# EAGLE design thumper2_v0001 (EAGLE 6.4)
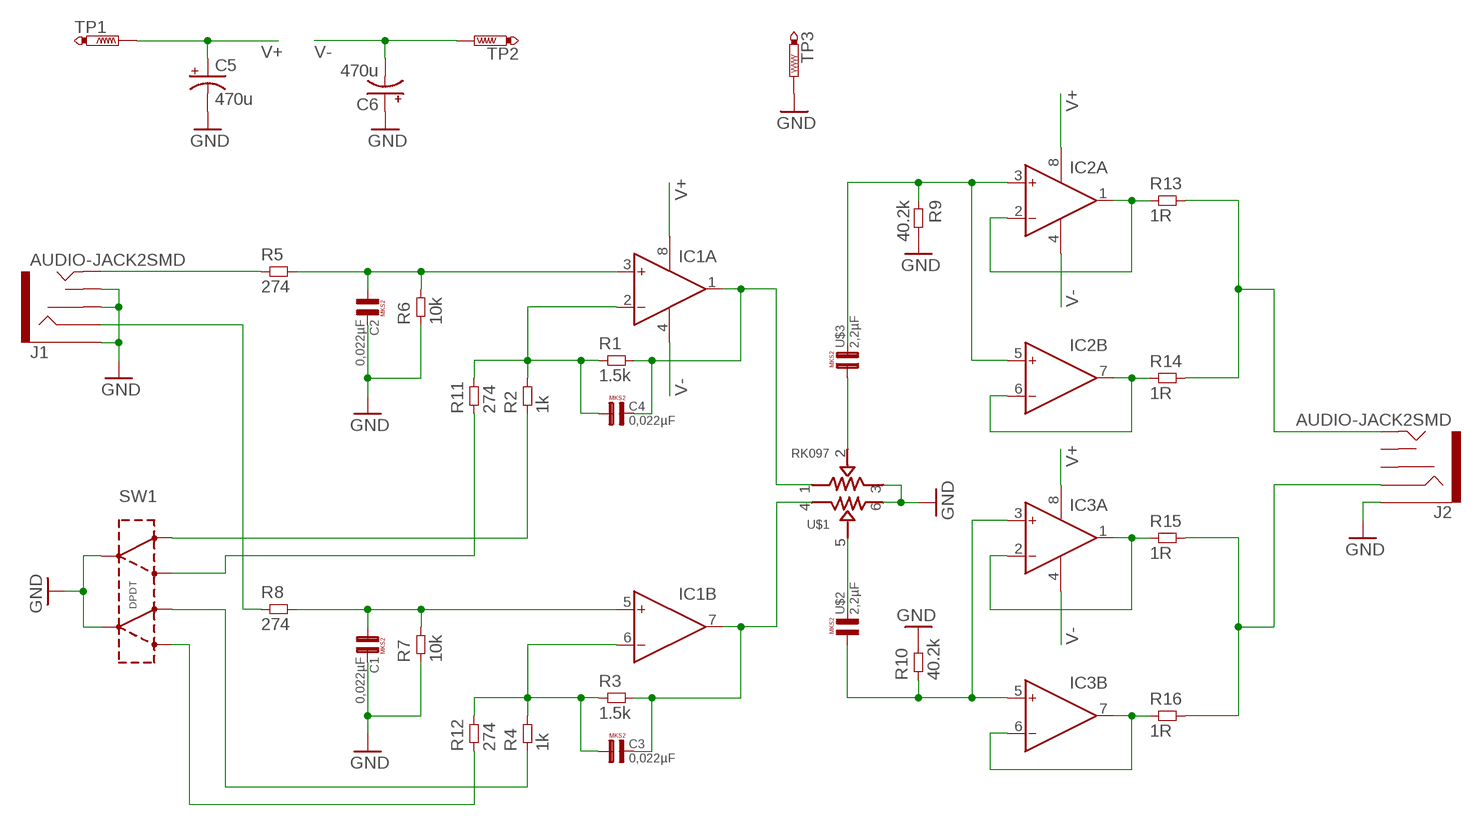
[diagram p0: schematic, sheet 1]

## Parts
C1  0,022µF  [R5B2K5]
C2  0,022µF  [R5B2K5]
C3  0,022µF  [R5B2K5]
C4  0,022µF  [R5B2K5]
C5  470u  CPOL-US153CLV-1010  [153CLV-1010]
C6  470u  CPOL-US153CLV-1010  [153CLV-1010]
IC1  AD8620R  [SO8]
IC2  AD8620R  [SO8]
IC3  AD8620R  [SO8]
J1  AUDIO-JACK2SMD  [AUDIO-JACK-3.5MM-SMD]
J2  AUDIO-JACK2SMD  [AUDIO-JACK-3.5MM-SMD]
R1  1.5k  RES0603L3  [0603L3]
R2  1k  RES0603L3  [0603L3]
R3  1.5k  RES0603L3  [0603L3]
R4  1k  RES0603L3  [0603L3]
R5  274  RES0603L3  [0603L3]
R6  10k  RES0603L3  [0603L3]
R7  10k  RES0603L3  [0603L3]
R8  274  RES0603L3  [0603L3]
R9  40.2k  RES0603L3  [0603L3]
R10  40.2k  RES0603L3  [0603L3]
R11  274  RES0603L3  [0603L3]
R12  274  RES0603L3  [0603L3]
R13  1R  RES1206L3  [1206L3]
R14  1R  RES1206L3  [1206L3]
R15  1R  RES1206L3  [1206L3]
R16  1R  RES1206L3  [1206L3]
SW1  DPDTDPDT-2X2.5  [DPDT-2X2.5]
TP1  PTR1PAD1-20  [P1-20]
TP2  PTR1PAD1-20  [P1-20]
TP3  PTR1PAD1-20  [P1-20]
U$1  RK097  [RK097]
U$2  2,2µF  [R5B7K2]
U$3  2,2µF  [R5B7K2]

## Nets
GND: C1.2 C2.2 C5.- C6.+ J1.RSH J1.SLEEVE J1.TSH J2.SLEEVE R6.P$1 R7.P$1 R9.P$2 R10.P$2 SW1.2(INA) SW1.5(INB) TP3.TP U$1.3 U$1.6
N$1: C2.1 IC1.3(A:IN+) R5.P$2 R6.P$2
N$2: C4.1 IC1.2(A:IN-) R1.P$1 R2.P$2 R11.P$2
N$3: C4.2 IC1.1(A:OUT) R1.P$2 U$1.1
N$4: C1.1 IC1.5(B:IN+) R7.P$2 R8.P$2
N$5: C3.2 IC1.7(B:OUT) R3.P$2 U$1.4
N$6: C3.1 IC1.6(B:IN-) R3.P$1 R4.P$2 R12.P$2
N$7: J2.TIP R13.2 R14.2
N$9: U$1.5 U$2.2
N$10: U$1.2 U$3.1
N$11: J2.RING R15.2 R16.2
N$12: IC3.3(A:IN+) IC3.5(B:IN+) R10.P$1 U$2.1
N$13: IC2.3(A:IN+) IC2.5(B:IN+) R9.P$1 U$3.2
N$14: IC2.6(B:IN-) IC2.7(B:OUT) R14.1
N$15: IC3.1(A:OUT) IC3.2(A:IN-) R15.1
N$16: IC3.6(B:IN-) IC3.7(B:OUT) R16.1
N$17: IC2.1(A:OUT) IC2.2(A:IN-) R13.1
N$19: R12.P$1 SW1.6(OUTB2)
N$20: R11.P$1 SW1.3(OUTA2)
N$21: R2.P$1 SW1.1(OUTA1)
N$22: R4.P$1 SW1.4(OUTB1)
N$24: J1.RING R8.P$1
N$25: J1.TIP R5.P$1
V+: C5.+ IC1.8(P:V+) IC2.8(P:V+) IC3.8(P:V+) TP1.TP
V-: C6.- IC1.4(P:V-) IC2.4(P:V-) IC3.4(P:V-) TP2.TP
Unconnected: J2.RSH J2.TSH

## Library data of the parts
C1-C4 = Capacitor-Wima-MKS2-63v:0,022µF
C5 C6 = rcl:CPOL-US: POLARIZED CAPACITOR, American symbol
IC1-IC3 = analog-devices:AD8620: Precision, Very Low Noise, Low Input Bias Current, Wide Bandwidth JFET Operational Amplifiers Source: http://www.analog.com/static/imported-files/data_sheets/AD8610_8620.pdf; MF: ALTERA CORPORATION; MPN: AD8620ARZ; OC_FARNELL: 9994386; OC_NEWARK: 59K6972
J1 J2 = SparkFun-Connectors:AUDIO-JACK2: Stereo audio jack with bypass switches. Used on LilyPad MP3 board. Production SKU: CONN-10353; PROD_ID: CONN-10353
R1-R16 = common:RES
SW1 = common:DPDT
TP1-TP3 = testpad:PTR1: TEST PIN
U$1 = SparkFun-Electromechanical:RK097
U$2 U$3 = Capacitor-Wima-MKS2-63v:2,2µF

## Board
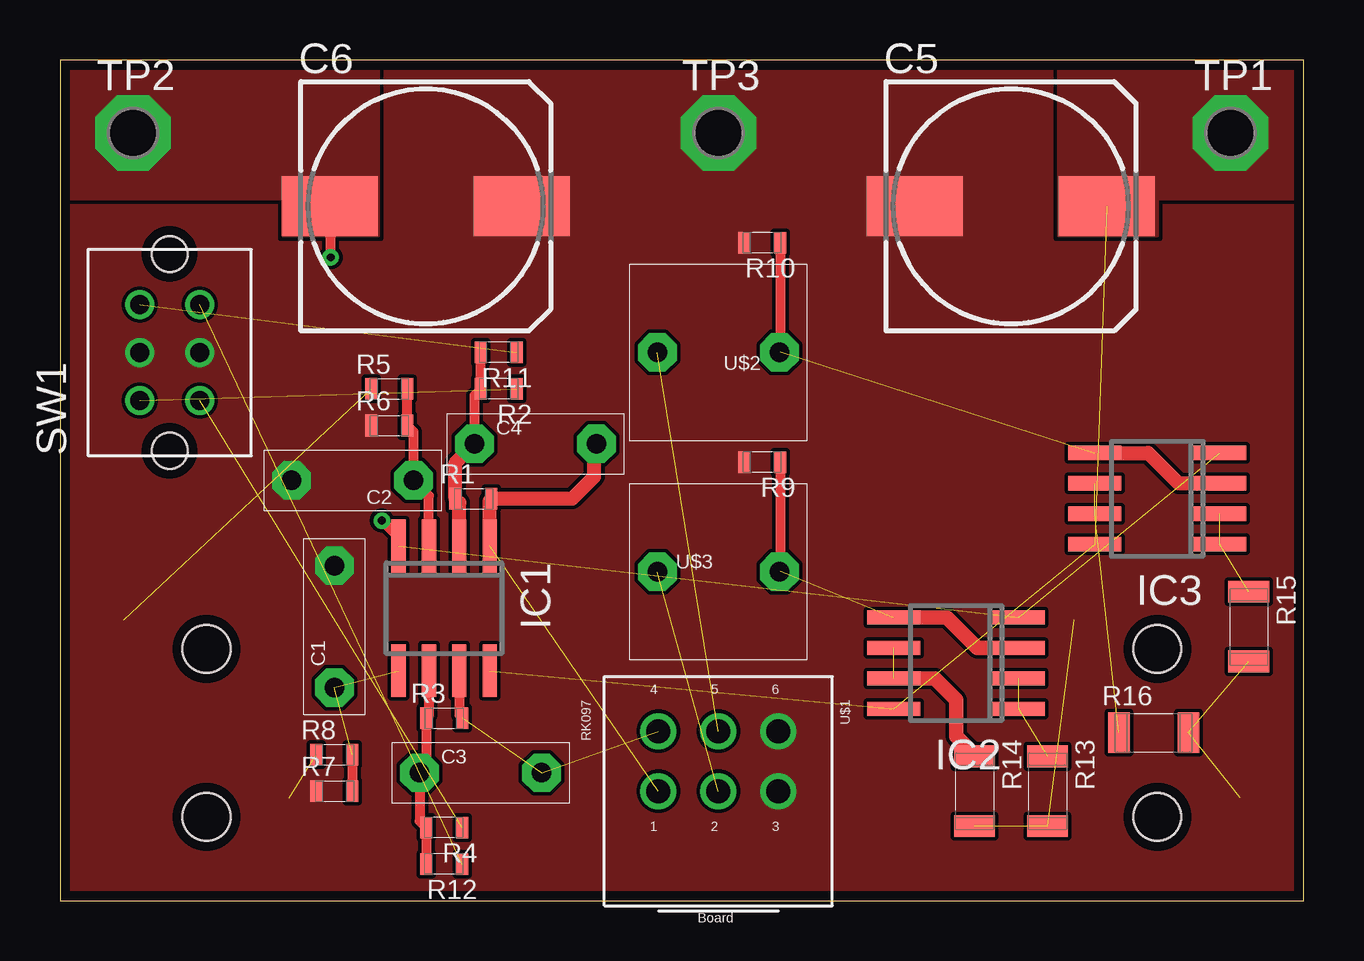
[diagram p1: board, top side]
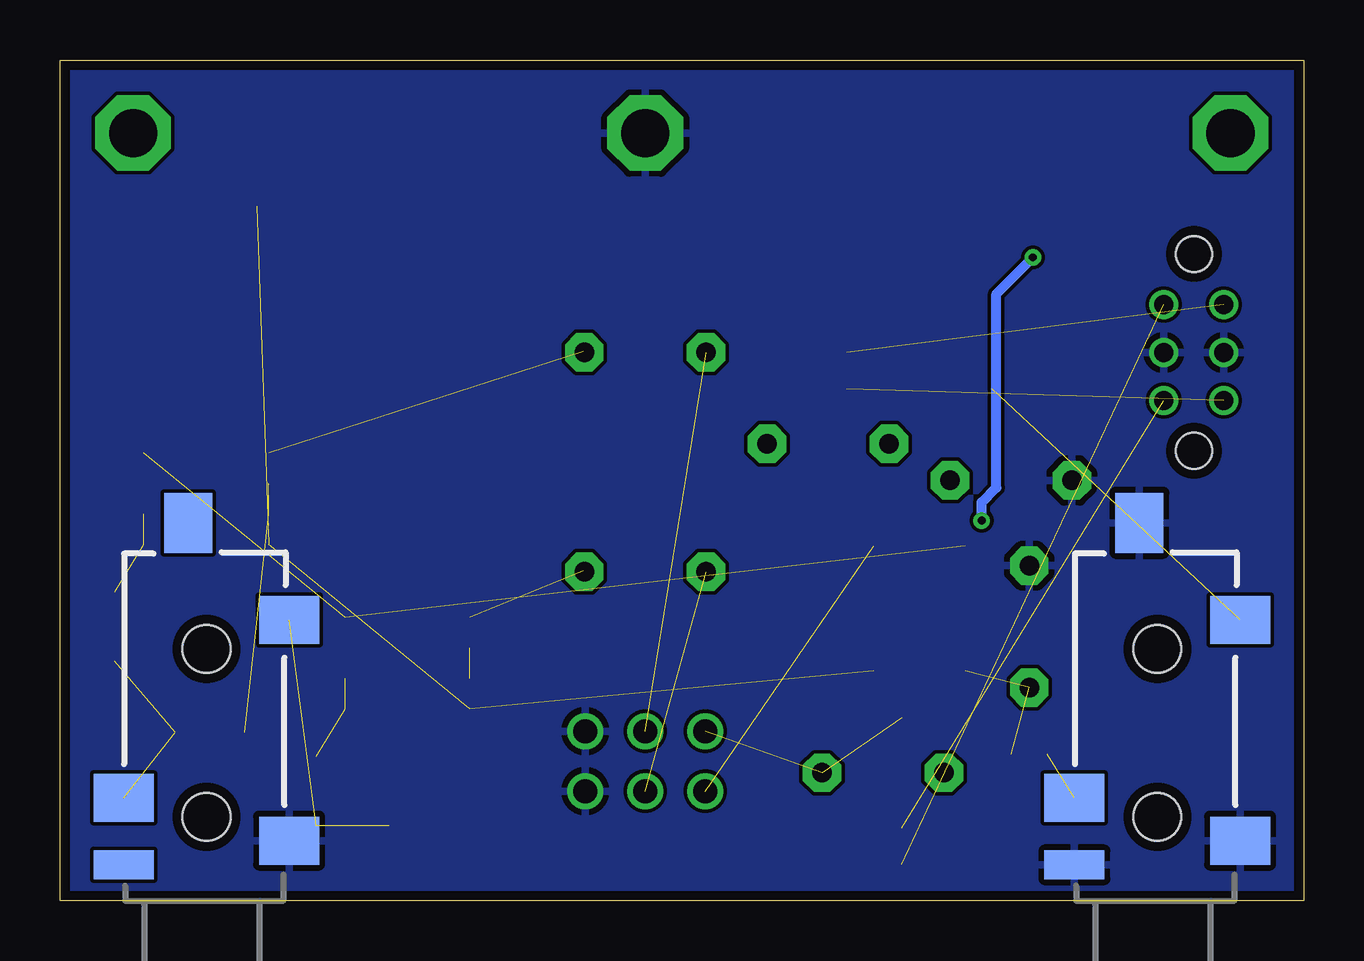
[diagram p2: board, bottom side, seen from below]

Size 51.82 x 35.05 mm. Coordinates in mm from the lower left corner, seen from the top.
Outline: 0,0 51.82,0 51.82,35.05 0,35.05 0,0
Copper layers (1*16): Top 0.035mm / dielectric 1.5mm / Bottom 0.035mm
Design rules "default *": minimum track width 6mil, minimum drill 13mil, track to track 6mil, track to pad 6mil, pad to pad 6mil, via to via 6mil, smd to smd 6mil, copper to edge 16mil, drill to drill 6mil, minimum pad ring 7mil, minimum via ring 7mil, stop-mask expansion 4mil, vias tented up to drill 16mil, thermal gap 10mil

### Footprints (pad centres in the part's own frame; a part is rotated, then mirrored left to right if it is on the bottom)
R5B2K5 = drill 0.813 pad 1.6 octagon: 1 -2.54,0; 2 2.54,0
153CLV-1010 = smd 4 x 2.5: + 4,0; - -4,0
SO8 = smd 0.6 x 2.2: 1 -1.905,-2.6; 2 -0.635,-2.6; 3 0.635,-2.6; 4 1.905,-2.6; 5 1.905,2.6; 6 0.635,2.6; 7 -0.635,2.6; 8 -1.905,2.6
AUDIO-JACK-3.5MM-SMD = smd 2 x 2.5: RING 4.3,3.45; SLEEVE 2.5,-3.45; TIP 11.7,-3.45 | smd 1.2 x 2.5: RSH 1.5,3.45 | smd 2.5 x 2: TSH 15.75,0.75 | hole 2: 3.5,0; 10.5,0
0603L3 = smd 0.5 x 0.9: P$1 -0.75,0; P$2 0.75,0
1206L3 = smd 0.9 x 1.7: 1 -1.45,0; 2 1.45,0
DPDT-2X2.5 = drill 0.8: 1 -2,1.25; 2 0,1.25; 3 2,1.25; 4 -2,-1.25; 5 0,-1.25; 6 2,-1.25 | hole 1.5: -4.1,0; 4.1,0
P1-20 = drill 2.007 pad 3.15 octagon: TP 0,0
RK097 = drill 1: 1 2.5,0; 2 0,0; 3 -2.5,0; 4 2.5,-2.5; 5 0,-2.5; 6 -2.5,-2.5
R5B7K2 = drill 0.813 pad 1.6 octagon: 1 -2.54,0; 2 2.54,0

### Placement (x,y rotation side)
C1  11.43,11.43 90 top
C2  12.19,17.53 180 top
C3  17.53,5.33 0 top
C4  19.81,19.05 0 top
C5  39.62,28.96 0 top
C6  15.24,28.96 0 top
IC1  16,12.19 180 top
IC2  37.34,9.91 90 top
IC3  45.72,16.76 90 top
J1  6.1,0 90 bottom
J2  45.72,0 90 bottom
R1  17.22,16.76 0 top
R2  18.29,21.34 180 top
R3  16,7.62 0 top
R4  16,3.05 180 top
R5  13.72,21.34 0 top
R6  13.72,19.81 0 top
R7  11.43,4.57 0 top
R8  11.43,6.1 0 top
R9  29.26,18.29 180 top
R10  29.26,27.43 180 top
R11  18.29,22.86 180 top
R12  16,1.52 180 top
R13  41.15,4.57 270 top
R14  38.1,4.57 270 top
R15  49.53,11.43 270 top
R16  45.57,7.01 0 top
SW1  4.57,22.86 90 top
TP1  48.77,32 0 top
TP2  3.05,32 0 top
TP3  27.43,32 0 top
U$1  27.43,4.57 180 top
U$2  27.43,22.86 180 top
U$3  27.43,13.72 0 top

### Tracks (layer width: path | path; a pad name or v marks a point on that pad's centre or on a via)
GND
  pour Bottom: 0.3,34.75 51.51,34.75 51.51,0.3 0.3,0.3
  pour Top (rank 6, no thermals): 0.3,34.75 51.51,34.75 51.51,0.3 0.3,0.3
N$1
  Top 0.406: IC1.3 15.37,16.89 C2.1 14.73,19.55 R6.P$2 R5.P$2
N$2
  Top 0.406: C4.1 17.27,21.07 R2.P$2 R11.P$2
  Top 0.508: 16.64,16.6 R1.P$1
  Top 0.584: IC1.2 16.64,16.6 | R1.P$1 16.47,18.25 C4.1
N$3  (1 unrouted)
  Top 0.508: 17.91,16.7 R1.P$2
  Top 0.584: IC1.1 17.91,16.7 | R1.P$2 21.34,16.76 22.25,17.68 22.25,18.95 C4.2
N$4  (2 unrouted)
  Top 0.406: R8.P$2 R7.P$2
N$5  (2 unrouted)
  Top 0.406: IC1.7 16.64,7.74 R3.P$2
N$6
  Top 0.406: R12.P$2 R4.P$2 14.99,3.31 C3.1 15.25,5.6 R3.P$1 15.37,7.74 IC1.6
N$7  (2 unrouted)
N$9  (1 unrouted)
N$10  (1 unrouted)
N$11  (2 unrouted)
N$12  (1 unrouted)
  Top 0.406: R10.P$1 30.01,22.9 U$2.1
  Top 0.584: IC3.3 46.61,17.4 45.34,18.67 IC3.5
N$13  (1 unrouted)
  Top 0.406: R9.P$1 30.01,13.76 U$3.2
  Top 0.597: IC2.5 36.96,11.81 38.23,10.54 IC2.3
N$14  (1 unrouted)
  Top 0.584: 38.1,6.1 R14.1
  Top 0.597: IC2.7 36.45,9.27 37.34,8.38 37.34,6.86 38.1,6.1
N$15  (2 unrouted)
N$16  (2 unrouted)
N$17  (2 unrouted)
N$19  (1 unrouted)
N$20  (1 unrouted)
N$21  (1 unrouted)
N$22  (1 unrouted)
N$24  (1 unrouted)
N$25  (1 unrouted)
V+  (3 unrouted)
  pour Top (no thermals): 51.51,34.75 41.61,34.75 41.61,27.74 45.72,27.74 45.72,29.26 51.51,29.26
V-  (via drill 0.33)  (2 unrouted)
  Top 0.406: IC1.4 14.1,15.16 v13.41,15.85 | v11.28,26.82 11.28,28.92 C6.-
  Bottom 0.406: v13.41,15.85 13.41,16.61 12.8,17.22 12.8,25.3 v11.28,26.82
  pour Top (no thermals): 13.26,30.18 13.26,34.75 0.3,34.75 0.3,29.26 9.3,29.26 9.3,27.74 13.26,27.74